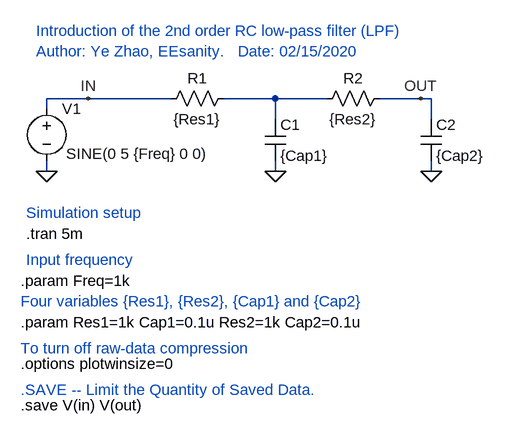
[diagram p0: schematic Project_2nd_LPF_TRAN.asc]
Project_2nd_LPF_TRAN.asc, the LTspice schematic file:
Version 4
SHEET 1 1728 680
WIRE 128 64 64 64
WIRE 256 64 128 64
WIRE 416 64 336 64
WIRE 496 64 416 64
WIRE 640 64 576 64
WIRE 656 64 640 64
WIRE 64 80 64 64
WIRE 416 96 416 64
WIRE 656 96 656 64
WIRE 64 176 64 160
WIRE 416 176 416 160
WIRE 656 176 656 160
FLAG 64 176 0
FLAG 416 176 0
FLAG 128 64 IN
FLAG 656 176 0
FLAG 640 64 OUT
SYMBOL voltage 64 64 R0
WINDOW 123 0 0 Left 2
WINDOW 39 0 0 Left 2
WINDOW 3 30 85 Left 2
SYMATTR Value SINE(0 5 {Freq} 0 0)
SYMATTR InstName V1
SYMBOL res 352 48 R90
WINDOW 0 0 56 VBottom 2
WINDOW 3 32 56 VTop 2
SYMATTR InstName R1
SYMATTR Value {Res1}
SYMBOL cap 400 96 R0
SYMATTR InstName C1
SYMATTR Value {Cap1}
SYMBOL cap 640 96 R0
SYMATTR InstName C2
SYMATTR Value {Cap2}
SYMBOL res 592 48 R90
WINDOW 0 0 56 VBottom 2
WINDOW 3 32 56 VTop 2
SYMATTR InstName R2
SYMATTR Value {Res2}
TEXT 32 272 Left 2 !.tran 5m
TEXT 48 -40 Left 2 ;Introduction of the 2nd order RC low-pass filter (LPF)\nAuthor: Ye Zhao, EEsanity.   Date: 02/15/2020
TEXT 24 536 Left 2 !.save V(in) V(out)
TEXT 24 512 Left 2 ;.SAVE -- Limit the Quantity of Saved Data.
TEXT 24 472 Left 2 !.options plotwinsize=0
TEXT 24 448 Left 2 ;To turn off raw-data compression
TEXT 32 240 Left 2 ;Simulation setup
TEXT 24 344 Left 2 !.param Freq=1k
TEXT 32 312 Left 2 ;Input frequency
TEXT 24 408 Left 2 !.param Res1=1k Cap1=0.1u Res2=1k Cap2=0.1u
TEXT 24 376 Left 2 ;Four variables {Res1}, {Res2}, {Cap1} and {Cap2}

The netlist it stands for:
* Project_2nd_LPF_TRAN.asc
V1 IN 0 SINE(0 5 {Freq} 0 0)
R1 N001 IN {Res1}
C1 N001 0 {Cap1}
C2 OUT 0 {Cap2}
R2 OUT N001 {Res2}
.tran 5m
* Introduction of the 2nd order RC low-pass filter (LPF)
* Author: Ye Zhao, EEsanity.   Date: 02/15/2020
.save V(in) V(out)
* .SAVE -- Limit the Quantity of Saved Data.
.options plotwinsize=0
* To turn off raw-data compression
* Simulation setup
.param Freq=1k
* Input frequency
.param Res1=1k Cap1=0.1u Res2=1k Cap2=0.1u
* Four variables {Res1}, {Res2}, {Cap1} and {Cap2}
.backanno
.end